# EAGLE schematic Genus_MainBoard_Std - v.1.0 (EAGLE 9.5.2)

## Sheet 1 of 3
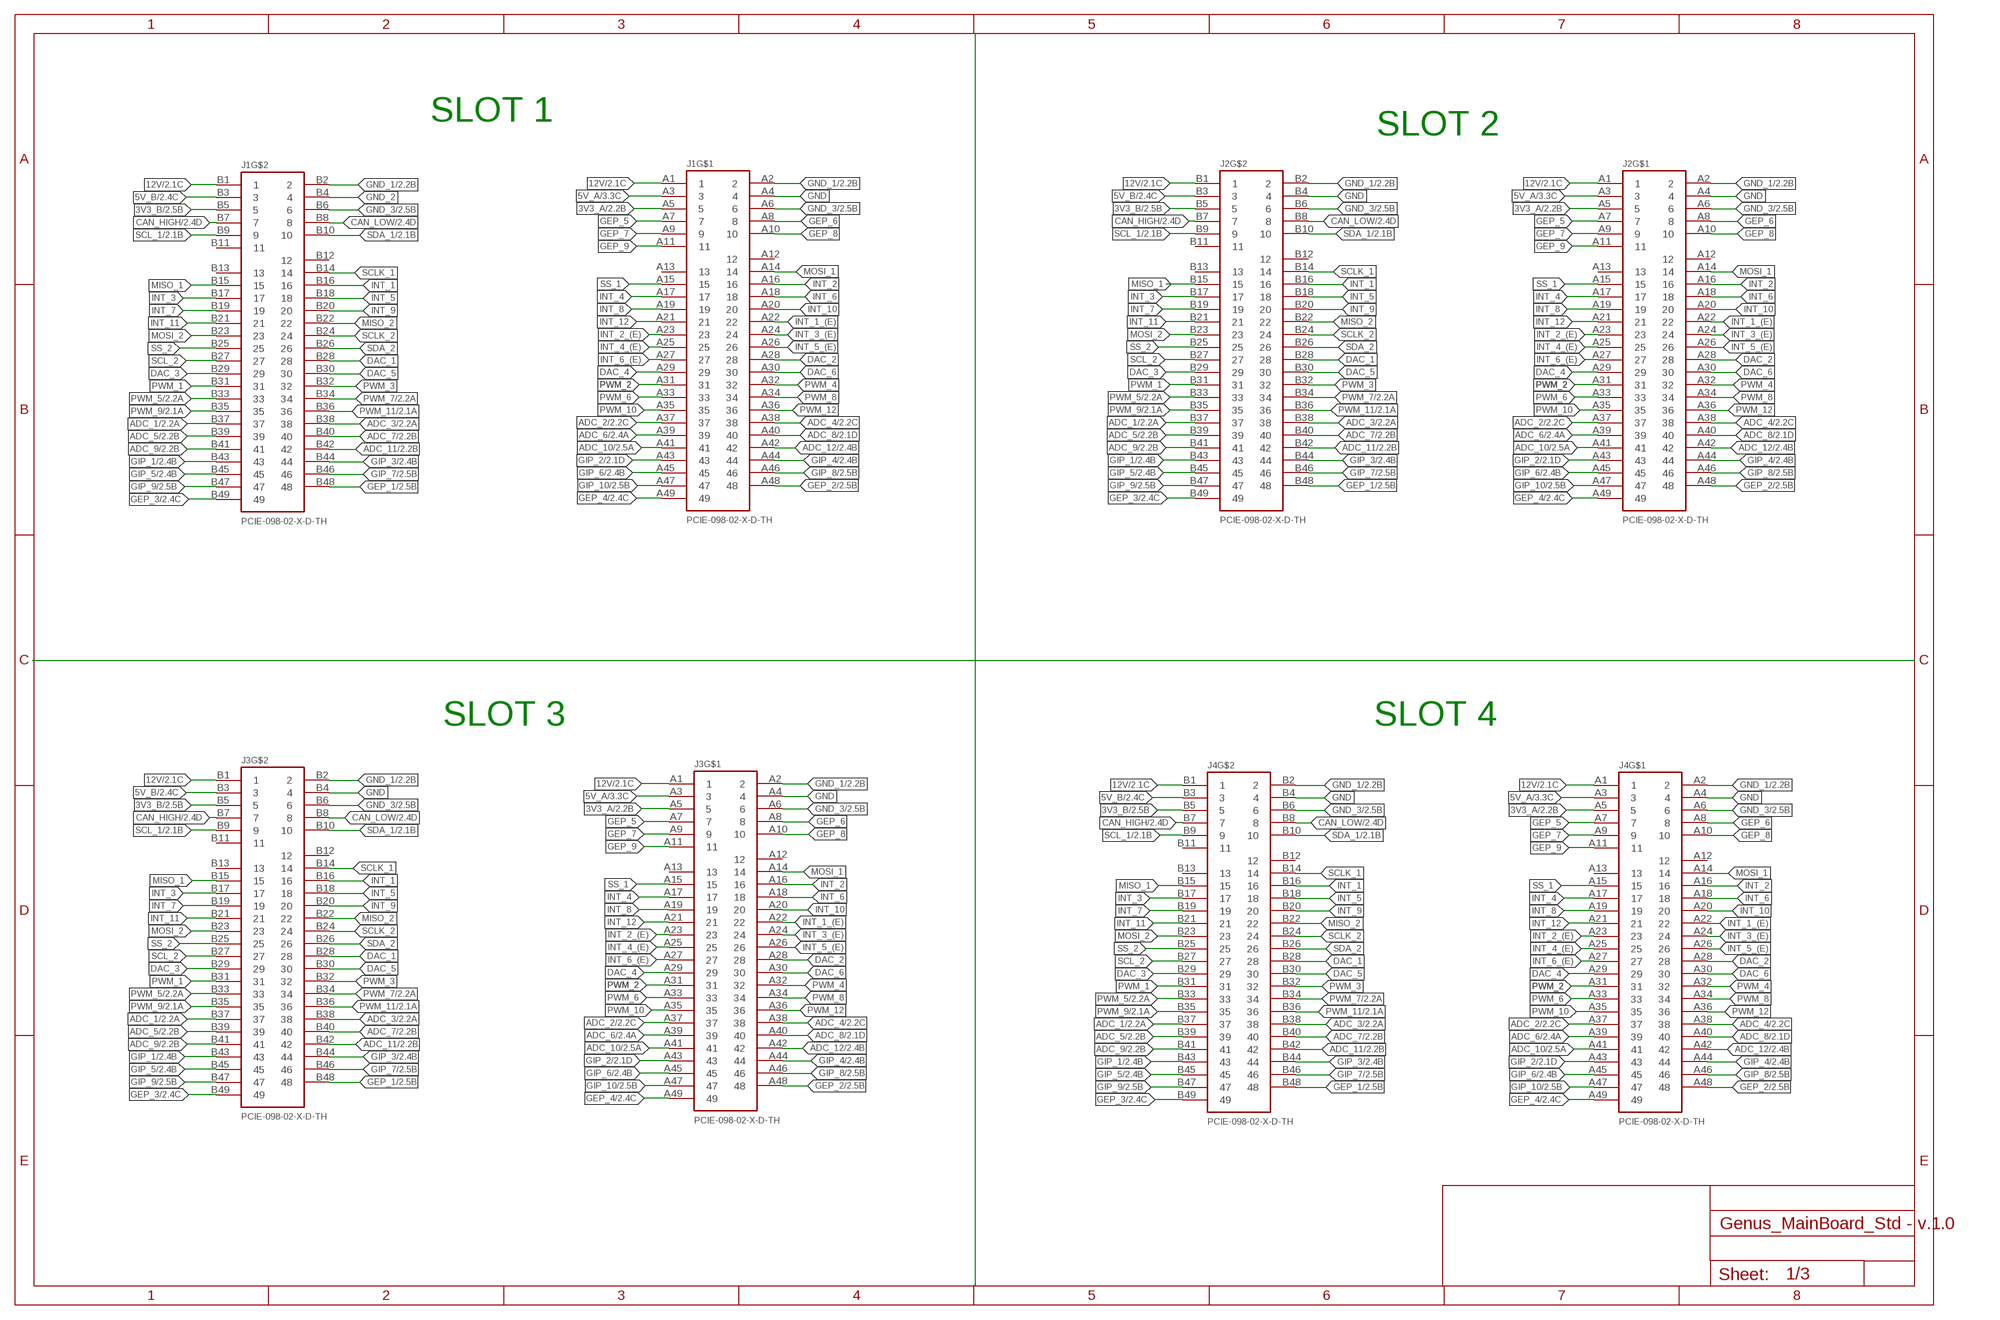
[diagram p0: schematic, sheet 1]

### Parts
J1  PCIE-098-02-X-D-TH  [PCIE-098-02-X-D-TH]
J2  PCIE-098-02-X-D-TH  [PCIE-098-02-X-D-TH]
J3  PCIE-098-02-X-D-TH  [PCIE-098-02-X-D-TH]
J4  PCIE-098-02-X-D-TH  [PCIE-098-02-X-D-TH]

### Nets
3V3_A: J1.A5 J2.A5 J3.A5 J4.A5 ; also sheet 2,3
3V3_B: J1.B5 J2.B5 J3.B5 J4.B5 ; also sheet 2,3
5V_A: J1.A3 J2.A3 J3.A3 J4.A3 ; also sheet 3
5V_B: J1.B3 J2.B3 J3.B3 J4.B3 ; also sheet 2,3
12V: J1.A1 J1.B1 J2.A1 J2.B1 J3.A1 J3.B1 J4.A1 J4.B1 ; also sheet 2,3
ADC_1: J1.B37 J2.B37 J3.B37 J4.B37 ; also sheet 2,3
ADC_2: J1.A37 J2.A37 J3.A37 J4.A37 ; also sheet 2
ADC_3: J1.B38 J2.B38 J3.B38 J4.B38 ; also sheet 2,3
ADC_4: J1.A38 J2.A38 J3.A38 J4.A38 ; also sheet 2
ADC_5: J1.B39 J2.B39 J3.B39 J4.B39 ; also sheet 2
ADC_6: J1.A39 J2.A39 J3.A39 J4.A39 ; also sheet 2
ADC_7: J1.B40 J2.B40 J3.B40 J4.B40 ; also sheet 2
ADC_8: J1.A40 J2.A40 J3.A40 J4.A40 ; also sheet 2
ADC_9: J1.B41 J2.B41 J3.B41 J4.B41 ; also sheet 2
ADC_10: J1.A41 J2.A41 J3.A41 J4.A41 ; also sheet 2
ADC_11: J1.B42 J2.B42 J3.B42 J4.B42 ; also sheet 2
ADC_12: J1.A42 J2.A42 J3.A42 J4.A42 ; also sheet 2
CAN_HIGH: J1.B7 J2.B7 J3.B7 J4.B7 ; also sheet 2
CAN_LOW: J1.B8 J2.B8 J3.B8 J4.B8 ; also sheet 2
DAC_1: J1.B28 J2.B28 J3.B28 J4.B28
DAC_2: J1.A28 J2.A28 J3.A28 J4.A28
DAC_3: J1.B29 J2.B29 J3.B29 J4.B29
DAC_4: J1.A29 J2.A29 J3.A29 J4.A29
DAC_5: J1.B30 J2.B30 J3.B30 J4.B30
DAC_6: J1.A30 J2.A30 J3.A30 J4.A30
GEP_1: J1.B48 J2.B48 J3.B48 J4.B48 ; also sheet 2
GEP_2: J1.A48 J2.A48 J3.A48 J4.A48 ; also sheet 2
GEP_3: J1.B49 J2.B49 J3.B49 J4.B49 ; also sheet 2
GEP_4: J1.A49 J2.A49 J3.A49 J4.A49 ; also sheet 2
GEP_5: J1.A7 J2.A7 J3.A7 J4.A7
GEP_6: J1.A8 J2.A8 J3.A8 J4.A8
GEP_7: J1.A9 J2.A9 J3.A9 J4.A9
GEP_8: J1.A10 J2.A10 J3.A10 J4.A10
GEP_9: J1.A11 J2.A11 J3.A11 J4.A11
GIP_1: J1.B43 J2.B43 J3.B43 J4.B43 ; also sheet 2
GIP_2: J1.A43 J2.A43 J3.A43 J4.A43 ; also sheet 2
GIP_3: J1.B44 J2.B44 J3.B44 J4.B44 ; also sheet 2
GIP_4: J1.A44 J2.A44 J3.A44 J4.A44 ; also sheet 2
GIP_5: J1.B45 J2.B45 J3.B45 J4.B45 ; also sheet 2
GIP_6: J1.A45 J2.A45 J3.A45 J4.A45 ; also sheet 2
GIP_7: J1.B46 J2.B46 J3.B46 J4.B46 ; also sheet 2
GIP_8: J1.A46 J2.A46 J3.A46 J4.A46 ; also sheet 2
GIP_9: J1.B47 J2.B47 J3.B47 J4.B47 ; also sheet 2
GIP_10: J1.A47 J2.A47 J3.A47 J4.A47 ; also sheet 2
GND: J1.A4 J2.A4 J2.B4 J3.A4 J3.B4 J4.A4 J4.B4 ; also sheet 2,3
GND_1: J1.A2 J1.B2 J2.A2 J2.B2 J3.A2 J3.B2 J4.A2 J4.B2 ; also sheet 2,3
GND_2: J1.B4
GND_3: J1.A6 J1.B6 J2.A6 J2.B6 J3.A6 J3.B6 J4.A6 J4.B6 ; also sheet 2,3
INT_1: J1.B16 J2.B16 J3.B16 J4.B16
INT_1_(E): J1.A22 J2.A22 J3.A22 J4.A22
INT_2: J1.A16 J2.A16 J3.A16 J4.A16
INT_2_(E): J1.A23 J2.A23 J3.A23 J4.A23
INT_3: J1.B17 J2.B17 J3.B17 J4.B17
INT_3_(E): J1.A24 J2.A24 J3.A24 J4.A24
INT_4: J1.A17 J2.A17 J3.A17 J4.A17
INT_4_(E): J1.A25 J2.A25 J3.A25 J4.A25
INT_5: J1.B18 J2.B18 J3.B18 J4.B18
INT_5_(E): J1.A26 J2.A26 J3.A26 J4.A26
INT_6: J1.A18 J2.A18 J3.A18 J4.A18
INT_6_(E): J1.A27 J2.A27 J3.A27 J4.A27
INT_7: J1.B19 J2.B19 J3.B19 J4.B19
INT_8: J1.A19 J2.A19 J3.A19 J4.A19
INT_9: J1.B20 J2.B20 J3.B20 J4.B20
INT_10: J1.A20 J2.A20 J3.A20 J4.A20
INT_11: J1.B21 J2.B21 J3.B21 J4.B21
INT_12: J1.A21 J2.A21 J3.A21 J4.A21
MISO_1: J1.B15 J2.B15 J3.B15 J4.B15
MISO_2: J1.B22 J2.B22 J3.B22 J4.B22
MOSI_1: J1.A14 J2.A14 J3.A14 J4.A14
MOSI_2: J1.B23 J2.B23 J3.B23 J4.B23
PWM_1: J1.B31 J2.B31 J3.B31 J4.B31
PWM_2: J1.A31 J2.A31 J3.A31 J4.A31
PWM_3: J1.B32 J2.B32 J3.B32 J4.B32
PWM_4: J1.A32 J2.A32 J3.A32 J4.A32
PWM_5: J1.B33 J2.B33 J3.B33 J4.B33 ; also sheet 2
PWM_6: J1.A33 J2.A33 J3.A33 J4.A33
PWM_7: J1.B34 J2.B34 J3.B34 J4.B34 ; also sheet 2
PWM_8: J1.A34 J2.A34 J3.A34 J4.A34
PWM_9: J1.B35 J2.B35 J3.B35 J4.B35 ; also sheet 2
PWM_10: J1.A35 J2.A35 J3.A35 J4.A35
PWM_11: J1.B36 J2.B36 J3.B36 J4.B36 ; also sheet 2
PWM_12: J1.A36 J2.A36 J3.A36 J4.A36
SCL_1: J1.B9 J2.B9 J3.B9 J4.B9 ; also sheet 2
SCL_2: J1.B27 J2.B27 J3.B27 J4.B27
SCLK_1: J1.B14 J2.B14 J3.B14 J4.B14
SCLK_2: J1.B24 J2.B24 J3.B24 J4.B24
SDA_1: J1.B10 J2.B10 J3.B10 J4.B10 ; also sheet 2
SDA_2: J1.B26 J2.B26 J3.B26 J4.B26
SS_1: J1.A15 J2.A15 J3.A15 J4.A15
SS_2: J1.B25 J2.B25 J3.B25 J4.B25
Unconnected: J1.A12 J1.A13 J1.B11 J1.B12 J1.B13 J2.A12 J2.A13 J2.B11 J2.B12 J2.B13 J3.A12 J3.A13 J3.B11 J3.B12 J3.B13 J4.A12 J4.A13 J4.B11 J4.B12 J4.B13

### Notes on the sheet
- SLOT 1
- SLOT 2
- SLOT 3 | SLOT 4

## Sheet 2 of 3
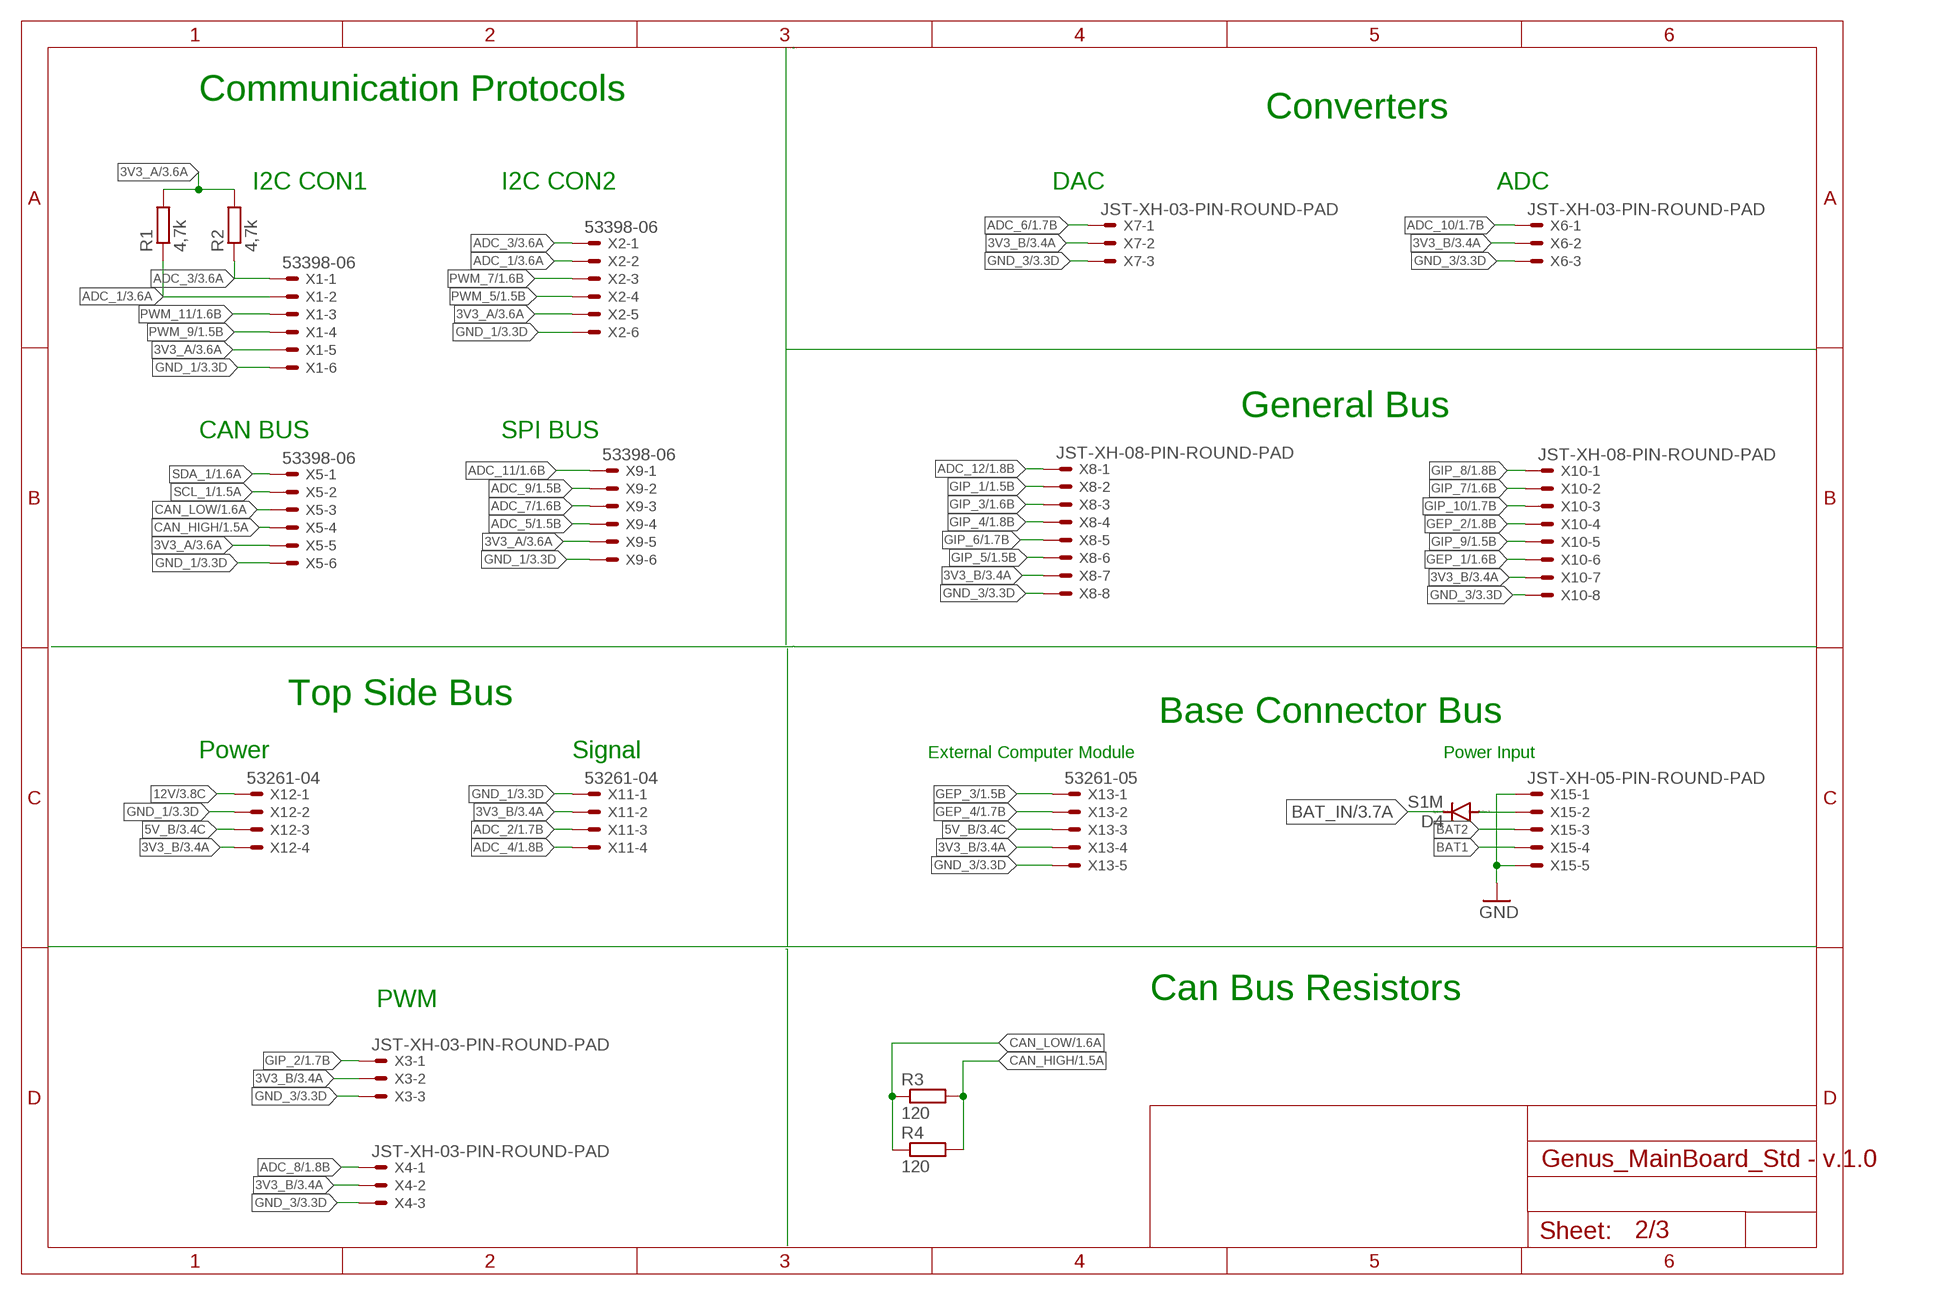
[diagram p1: schematic, sheet 2]

### Parts
D4  S1M  [SMA]
R1  4,7k  R-EU_R0805  [R0805]
R2  4,7k  R-EU_R0805  [R0805]
R3  120  R-EU_R0805  [R0805]
R4  120  R-EU_R0805  [R0805]
X1  53398-06  [53398-06]
X2  53398-06  [53398-06]
X3  JST-XH-03-PIN-ROUND-PAD  [JST-XH-03-PACKAGE-ROUND-PAD]
X4  JST-XH-03-PIN-ROUND-PAD  [JST-XH-03-PACKAGE-ROUND-PAD]
X5  53398-06  [53398-06]
X6  JST-XH-03-PIN-ROUND-PAD  [JST-XH-03-PACKAGE-ROUND-PAD]
X7  JST-XH-03-PIN-ROUND-PAD  [JST-XH-03-PACKAGE-ROUND-PAD]
X8  JST-XH-08-PIN-ROUND-PAD  [JST-XH-08-PACKAGE-ROUND-PAD]
X9  53398-06  [53398-06]
X10  JST-XH-08-PIN-ROUND-PAD  [JST-XH-08-PACKAGE-ROUND-PAD]
X11  53261-04  [53261-04]
X12  53261-04  [53261-04]
X13  53261-05  [53261-05]
X15  JST-XH-05-PIN-ROUND-PAD  [JST-XH-05-PACKAGE-ROUND-PAD]

### Nets
3V3_A: R1.2 R2.2 X1.5 X2.5 X5.5 X9.5 ; also sheet 1,3
3V3_B: X3.2 X4.2 X6.2 X7.2 X8.7 X10.7 X11.2 X12.4 X13.4 ; also sheet 1,3
5V_B: X12.3 X13.3 ; also sheet 1,3
12V: X12.1 ; also sheet 1,3
ADC_1: R1.1 X1.2 X2.2 ; also sheet 1,3
ADC_2: X11.3 ; also sheet 1
ADC_3: R2.1 X1.1 X2.1 ; also sheet 1,3
ADC_4: X11.4 ; also sheet 1
ADC_5: X9.4 ; also sheet 1
ADC_6: X7.1 ; also sheet 1
ADC_7: X9.3 ; also sheet 1
ADC_8: X4.1 ; also sheet 1
ADC_9: X9.2 ; also sheet 1
ADC_10: X6.1 ; also sheet 1
ADC_11: X9.1 ; also sheet 1
ADC_12: X8.1 ; also sheet 1
BAT1: X15.4
BAT2: X15.3
BAT_IN: D4.C ; also sheet 3
CAN_HIGH: R3.2 R4.2 X5.4 ; also sheet 1
CAN_LOW: R3.1 R4.1 X5.3 ; also sheet 1
GEP_1: X10.6 ; also sheet 1
GEP_2: X10.4 ; also sheet 1
GEP_3: X13.1 ; also sheet 1
GEP_4: X13.2 ; also sheet 1
GIP_1: X8.2 ; also sheet 1
GIP_2: X3.1 ; also sheet 1
GIP_3: X8.3 ; also sheet 1
GIP_4: X8.4 ; also sheet 1
GIP_5: X8.6 ; also sheet 1
GIP_6: X8.5 ; also sheet 1
GIP_7: X10.2 ; also sheet 1
GIP_8: X10.1 ; also sheet 1
GIP_9: X10.5 ; also sheet 1
GIP_10: X10.3 ; also sheet 1
GND: X15.1 X15.5 ; also sheet 1,3
GND_1: X1.6 X2.6 X5.6 X9.6 X11.1 X12.2 ; also sheet 1,3
GND_3: X3.3 X4.3 X6.3 X7.3 X8.8 X10.8 X13.5 ; also sheet 1,3
N$6: D4.A X15.2
PWM_5: X2.4 ; also sheet 1
PWM_7: X2.3 ; also sheet 1
PWM_9: X1.4 ; also sheet 1
PWM_11: X1.3 ; also sheet 1
SCL_1: X5.2 ; also sheet 1
SDA_1: X5.1 ; also sheet 1

### Notes on the sheet
- Communication Protocols
- Converters
- I2C CON1 | I2C CON2 | DAC | ADC
- General Bus
- CAN BUS | SPI BUS
- Top Side Bus
- Base Connector Bus
- Power | Signal | External Computer Module | Power Input
- PWM | Can Bus Resistors

## Sheet 3 of 3
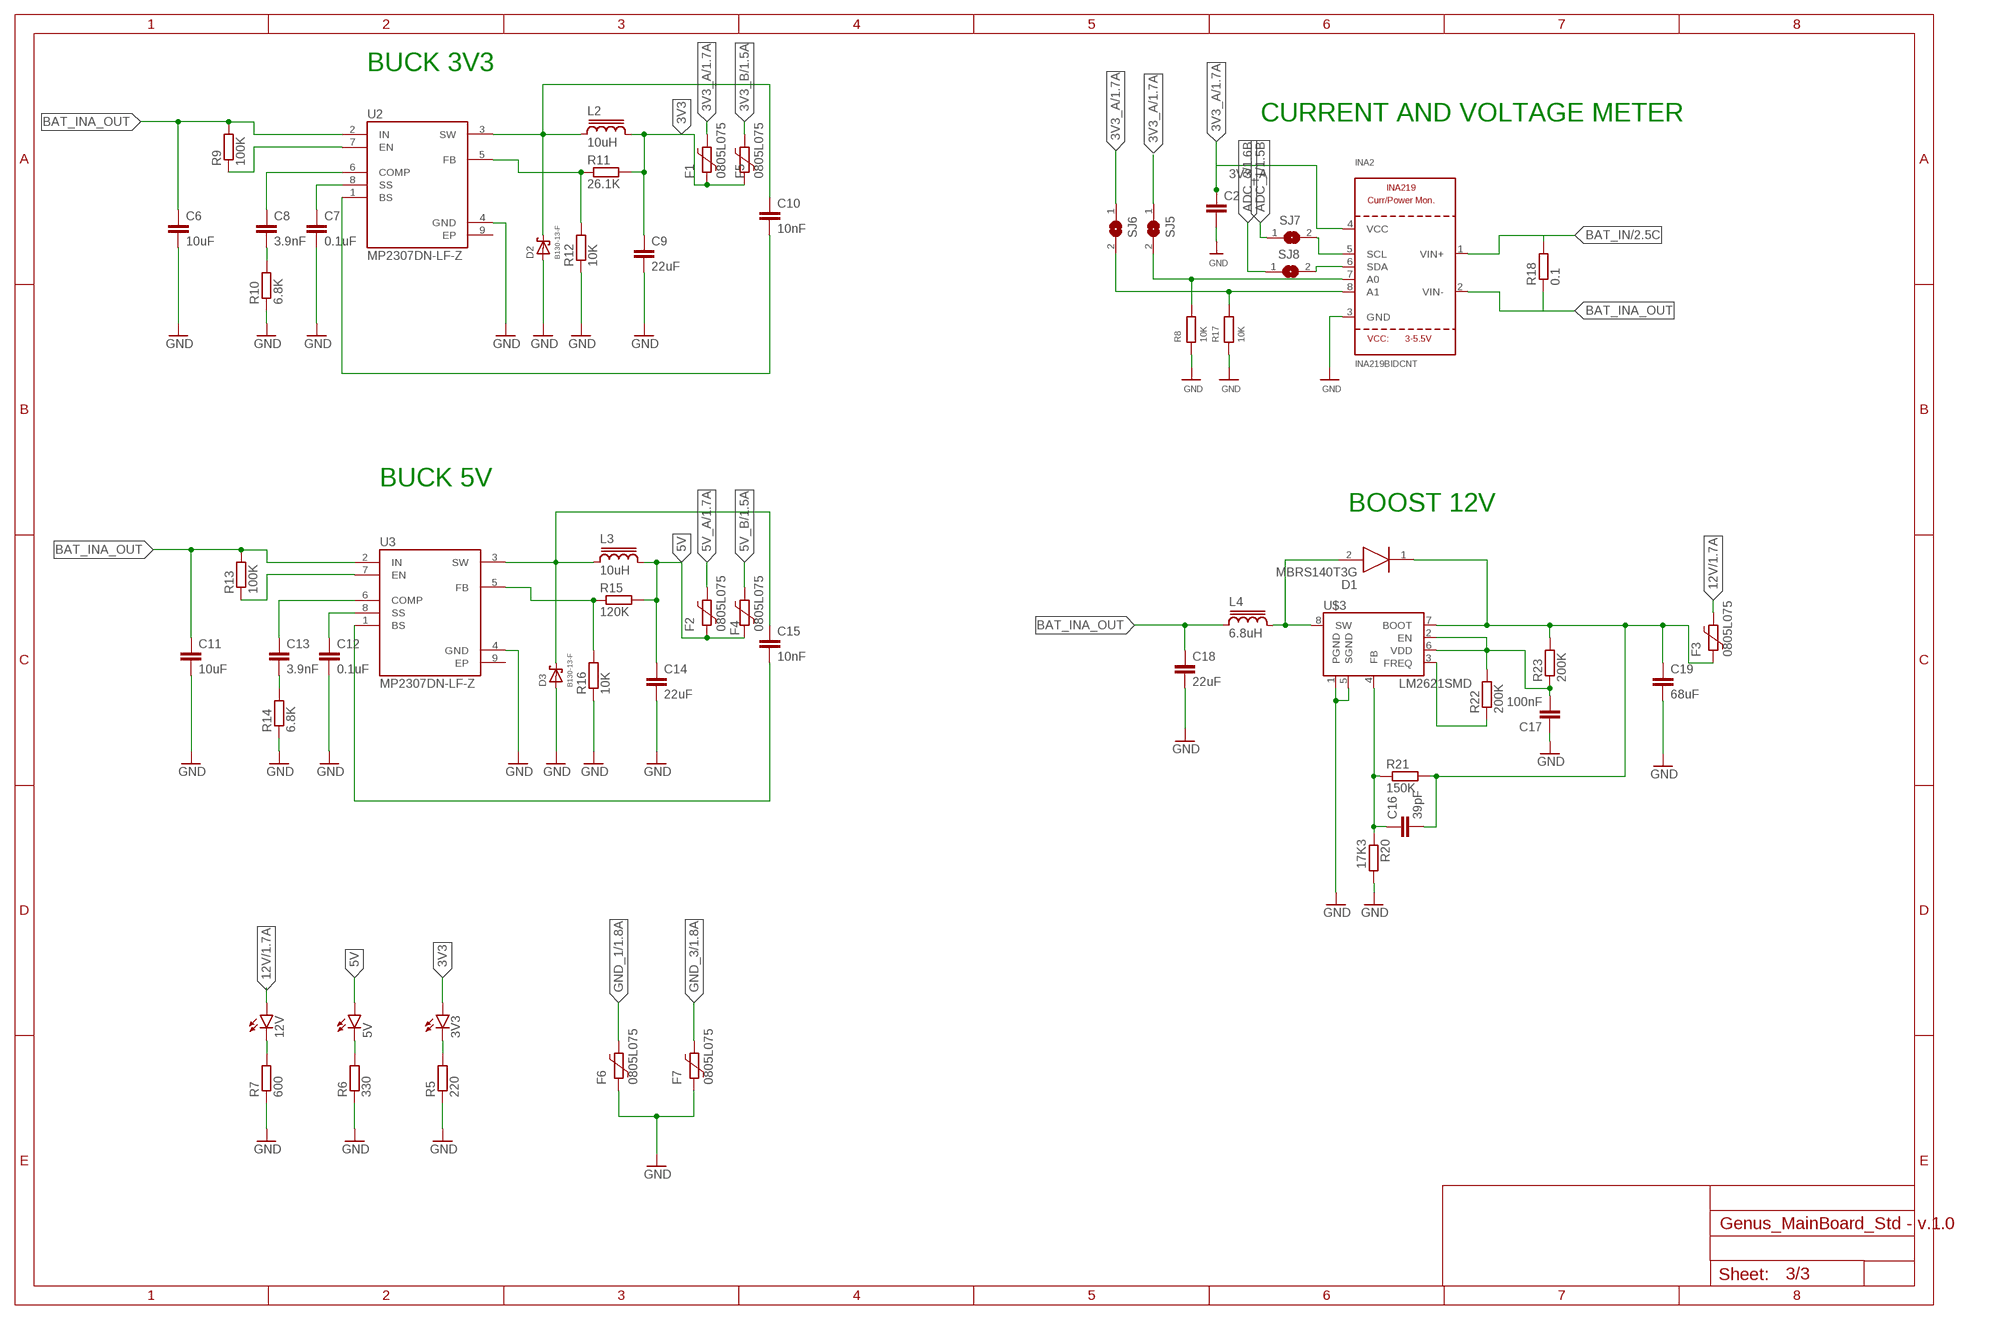
[diagram p2: schematic, sheet 3]

### Parts
3V3  LEDCHIP-LED0805  [CHIP-LED0805]
5V  LEDCHIP-LED0805  [CHIP-LED0805]
12V  LEDCHIP-LED0805  [CHIP-LED0805]
C2  C-EUC0805  [C0805]
C6  10uF  C-EUC0805  [C0805]
C7  0.1uF  C-EUC0805  [C0805]
C8  3.9nF  C-EUC0805  [C0805]
C9  22uF  C-EUC0805  [C0805]
C10  10nF  C-EUC0805  [C0805]
C11  10uF  C-EUC0805  [C0805]
C12  0.1uF  C-EUC0805  [C0805]
C13  3.9nF  C-EUC0805  [C0805]
C14  22uF  C-EUC0805  [C0805]
C15  10nF  C-EUC0805  [C0805]
C16  39pF  C-EUC0805  [C0805]
C17  100nF  C-EUC0805  [C0805]
C18  22uF  C-EUC1210  [C1210]
C19  68uF  C-EUC1210  [C1210]
D1  MBRS140T3G  [DIOM5436X247N]
D2  B130-13-F  [SMA]
D3  B130-13-F  [SMA]
F1  0805L075  [0805L]
F2  0805L075  [0805L]
F3  0805L075  [0805L]
F4  0805L075  [0805L]
F5  0805L075  [0805L]
F6  0805L075  [0805L]
F7  0805L075  [0805L]
INA2  INA219BIDCNT  INA219  [SOT23-8]
L2  10uH  SRR1280  [SRR1280]
L3  10uH  SRR1280  [SRR1280]
L4  6.8uH  SRR1280  [SRR1280]
R5  220  R-EU_R0805  [R0805]
R6  330  R-EU_R0805  [R0805]
R7  600  R-EU_R0805  [R0805]
R8  10K  R-EU_R0805  [R0805]
R9  100K  R-EU_R0805  [R0805]
R10  6.8K  R-EU_R0805  [R0805]
R11  26.1K  R-EU_R0805  [R0805]
R12  10K  R-EU_R0805  [R0805]
R13  100K  R-EU_R0805  [R0805]
R14  6.8K  R-EU_R0805  [R0805]
R15  120K  R-EU_R0805  [R0805]
R16  10K  R-EU_R0805  [R0805]
R17  10K  R-EU_R0805  [R0805]
R18  0.1  R-EU_R2512  [R2512]
R20  17K3  R-EU_R0805  [R0805]
R21  150K  R-EU_R0805  [R0805]
R22  200K  R-EU_R0805  [R0805]
R23  200K  R-EU_R0805  [R0805]
SJ5  SOLDERJUMPERREFLOW_NOPASTE  [SOLDERJUMPER_REFLOW_NOPASTE]
SJ6  SOLDERJUMPERREFLOW_NOPASTE  [SOLDERJUMPER_REFLOW_NOPASTE]
SJ7  SOLDERJUMPERREFLOW_NOPASTE  [SOLDERJUMPER_REFLOW_NOPASTE]
SJ8  SOLDERJUMPERREFLOW_NOPASTE  [SOLDERJUMPER_REFLOW_NOPASTE]
U2  MP2307DN-LF-Z  [SOIC127P600X170-9N]
U3  MP2307DN-LF-Z  [SOIC127P600X170-9N]
U$3  LM2621SMD  [MSOP-8]

### Nets
3V3: 3V3.A C9.1 F1.2 F5.2 L2.2 R11.2
3V3_A: C2.1 F1.1 INA2.4(VCC) SJ5.1 SJ6.1 ; also sheet 1,2
3V3_B: F5.1 ; also sheet 1,2
5V: 5V.A C14.1 F2.2 F4.2 L3.2 R15.2
5V_A: F2.1 ; also sheet 1
5V_B: F4.1 ; also sheet 1,2
12V: 12V.A F3.1 ; also sheet 1,2
ADC_1: SJ7.1 ; also sheet 1,2
ADC_3: SJ8.1 ; also sheet 1,2
BAT_IN: INA2.1(VIN+) R18.2 ; also sheet 2
BAT_INA_OUT: C6.1 C11.1 C18.1 INA2.2(VIN-) L4.1 R9.2 R13.2 R18.1 U2.2(IN) U3.2(IN)
GND: C2.2 C6.2 C7.2 C9.2 C11.2 C12.2 C14.2 C17.1 C18.2 C19.2 D2.A D3.A F6.2 F7.2 INA2.3(GND) R5.1 R6.1 R7.1 R8.1 R10.1 R12.1 R14.1 R16.1 R17.1 R20.2 U2.4(GND) U3.4(GND) U$3.1(PGND) U$3.5(SGND) ; also sheet 1,2
GND_1: F6.1 ; also sheet 1,2
GND_3: F7.1 ; also sheet 1,2
N$12: C16.2 C19.1 D1.1(K) F3.2 R21.2 R23.2 U$3.7(BOOT)
N$13: 12V.C R7.2
N$14: INA2.8(A1) R17.2 SJ6.2
N$15: INA2.7(A0) R8.2 SJ5.2
N$16: INA2.5(SCL) SJ7.2
N$17: R9.1 U2.7(EN)
N$18: C8.2 R10.2
N$19: C7.1 U2.8(SS)
N$20: C8.1 U2.6(COMP)
N$21: C10.1 D2.C L2.1 U2.3(SW)
N$22: R11.1 R12.2 U2.5(FB)
N$23: C10.2 U2.1(BS)
N$24: R13.1 U3.7(EN)
N$25: C13.2 R14.2
N$26: C12.1 U3.8(SS)
N$27: C13.1 U3.6(COMP)
N$28: C15.1 D3.C L3.1 U3.3(SW)
N$29: R15.1 R16.2 U3.5(FB)
N$30: C15.2 U3.1(BS)
N$31: INA2.6(SDA) SJ8.2
N$32: C16.1 R20.1 R21.1 U$3.4(FB)
N$33: D1.2(A) L4.2 U$3.8(SW)
N$34: C17.2 R22.2 R23.1 U$3.2(EN) U$3.6(VDD)
N$35: R22.1 U$3.3(FREQ)
N$36: 5V.C R6.2
N$37: 3V3.C R5.2

### Notes on the sheet
- BUCK 3V3
- CURRENT AND VOLTAGE METER
- BUCK 5V
- BOOST 12V

## Power pins joined to a net without a drawn wire
EP: U2.9(EP) U3.9(EP)

## Library data of the parts
3V3 5V 12V = led:LED: LED OSRAM: - CHIPLED LG R971, LG N971, LY N971, LG Q971, LY Q971, LO R971, LY R971 LH N974, LH R974 LS Q976, LO Q976, LY Q976 LO Q996 - Hyper CHIPLED LW Q18S LB Q993, LB Q99A, LB R99A - SideLED LS A670, LO A670, LY A670, LG A670, LP A670 LB A673, LV A673, LT A673, LW A673 LH A674 LY A675 LS A676, LA A676, LO A676, LY A676, LW A676 LS A679, LY A679, LG A679 - Hyper Micro SIDELED® LS Y876, LA Y876, LO Y876, LY Y876 LT Y87S - SmartLED LW L88C, LW L88S LB L89C, LB L89S, LG L890 LS L89K, LO L89K, LY L89K LS L896, LA L896, LO L896, LY L896 - TOPLED LS T670, LO T670, LY T670, LG T670, LP T670 LSG T670, LSP T670, LSY T670, LOP T670, LYG T670 LG T671, LOG T671, LSG T671 LB T673, LV T673, LT T673, LW T673 LH T674 LS T676, LA T676, LO T676, LY T676, LB T676, LH T676, LSB T676, LW T676 LB T67C, LV T67C, LT T67C, LS T67K, LO T67K, LY T67K, LW E67C LS E67B, LA E67B, LO E67B, LY E67B, LB E67C, LV E67C, LT E67C LW T67C LS T679, LY T679, LG T679 LS T770, LO T770, LY T770, LG T770, LP T770 LB T773, LV T773, LT T773, LW T773 LH T774 LS E675, LA E675, LY E675, LS T675 LS T776, LA T776, LO T776, LY T776, LB T776 LHGB T686 LT T68C, LB T68C - Hyper Mini TOPLED® LB M676 - Mini TOPLED Santana® LG M470 LS M47K, LO M47K, LY M47K Source: http://www.osram.convergy.de LUXEON: - LUMILED® LXK2-PW12-R00, LXK2-PW12-S00, LXK2-PW14-U00, LXK2-PW14-V00 LXK2-PM12-R00, LXK2-PM12-S00, LXK2-PM14-U00 LXK2-PE12-Q00, LXK2-PE12-R00, LXK2-PE12-S00, LXK2-PE14-T00, LXK2-PE14-U00 LXK2-PB12-K00, LXK2-PB12-L00, LXK2-PB12-M00, LXK2-PB14-N00, LXK2-PB14-P00, LXK2-PB14-Q00 LXK2-PR12-L00, LXK2-PR12-M00, LXK2-PR14-Q00, LXK2-PR14-R00 LXK2-PD12-Q00, LXK2-PD12-R00, LXK2-PD12-S00 LXK2-PH12-R00, LXK2-PH12-S00 LXK2-PL12-P00, LXK2-PL12-Q00, LXK2-PL12-R00 Source: www.luxeon.com KINGBRIGHT: KA-3528ASYC Source: www.kingbright.com
C2 C6-C19 = rcl:C-EU: CAPACITOR, European symbol; SPICEPREFIX: C
D1 = MBRS140T3G:MBRS140T3G: Source: Datasheet <http://www.onsemi.com/pub/Collateral/MBRS140T3-D.PDF>; ALLIED_NUMBER: 70099505; ALLIED_PRICE/STOCK: http://www.alliedelec.com/on-semiconductor-mbrs140t3g/70099505/; ARROW_PART_NUMBER: MBRS140T3G; ARROW_PRICE/STOCK: https://www.arrow.com/en/products/mbrs140t3g/on-semiconductor; HEIGHT: 2.47mm; MANUFACTURER_NAME: ON Semiconductor; MANUFACTURER_PART_NUMBER: MBRS140T3G; RS_PART_NUMBER: 5452074P; RS_PRICE/STOCK: http://uk.rs-online.com/web/p/products/5452074P
D2 D3 = B130-13-F:B130-13-F; AVAILABILITY: Unavailable; DESCRIPTION: Diode Schottky 30V 1A Surface Mount SMA; MF: Multicomp; MP: B130-13-F; PACKAGE: DO-214 Multicomp; PRICE: None
D4 = diode:S1M
F1-F7 = polyfuse-smd_10:?: Polyfuse Resettable PTC Source: http://www.littelfuse.com/products/resettable-ptcs.aspx; MF: Littelfuse; MPN: 0805L075; OC_FARNELL: 1832105RL; OC_NEWARK: 18M4777
INA2 = microbuilder:INA219: INA219 - I2C Current/Power Monitor Voltage Range: 0-26V Accuracy: 0.5% Temperature: -40°C - 125°C
J1-J4 = Z_BUS:PCIE-098-02-X-D-TH: PCI EXPRESS CARD CONNECTOR ,98 PINS.; AVAILABILITY: Unavailable; DESCRIPTION: 98 Position Female Connector PCI Express™ Gold 0.039 _1.00mm_ Black; MF: Samtec; MP: PCIE-098-02-F-D-TH; PACKAGE: None; PRICE: None
L2-L4 = inductor-bourns:SRR1280: POWER INDUCTOR
R1-R18 R20-R23 = rcl:R-EU_: RESISTOR, European symbol; SPICEPREFIX: R
SJ5-SJ8 = microbuilder:SOLDERJUMPER: SMD Solder JUMPER Solder the two pads together to create a connection, or remove the solder to break it. REFLOW - Use this footprint for solder paste and reflow ovens. WAVE - Use this footprint for hand-soldering (larger pads). CLOSED - Has a trace between the two pads to ensure it is closed by default. The trace needs to be cut to disable the jumper, and can be closed again by creating a solder bridge between the two pads.
U2 U3 = MP2307DN-LF-Z:MP2307DN-LF-Z: MP2307 Series 23 V 3 A 380 KHz Synchronous Rectified Step-Down Converter-SOIC-8; AVAILABILITY: Unavailable; DESCRIPTION: Buck Switching Regulator IC Positive Adjustable 0.925V 1 Output 3A 8-SOIC _0.154, 3.90mm Width_ Exposed Pad; MF: Monolithic Power; MP: MP2307DN-LF-Z; PACKAGE: SOIC-8 Monolithic Power; PRICE: None
U$3 = SparkFun-PowerIC:LM2621: Step-up switching regulator IC
X1 X2 X5 X9 = con-zenith:53?-06: CONNECTOR wire to board 1.25 mm (.049 inch) pitch header; MF: MOLEX; OC_FARNELL: 1125368; OC_NEWARK: unknown
X3 X4 X6 X7 = JST-XH-Zenith:JST-XH-03-PIN: JST XH Connector 2 Pin Wire to board connector. Pitch: 2,54 mm, (0.100") Number of pins: 3 Created by Rembrandt Electronics www.rembrandtelectronics.com
X8 X10 = JST-XH-Zenith:JST-XH-08-PIN: JST XH Connector 2 Pin Wire to board connector. Pitch: 2,54 mm, (0.100") Number of pins: 8 Created by Rembrandt Electronics www.rembrandtelectronics.com
X11 X12 = con-zenith:53?-04: CONNECTOR wire to board 1.25 mm (.049 inch) pitch header; MF: MOLEX; OC_FARNELL: 1125374; OC_NEWARK: unknown
X13 = con-zenith:53?-05: CONNECTOR wire to board 1.25 mm (.049 inch) pitch header; MF: MOLEX; OC_FARNELL: 1433644; OC_NEWARK: unknown
X15 = JST-XH-Zenith:JST-XH-05-PIN: JST XH Connector 2 Pin Wire to board connector. Pitch: 2,54 mm, (0.100") Number of pins: 5 Created by Rembrandt Electronics www.rembrandtelectronics.com